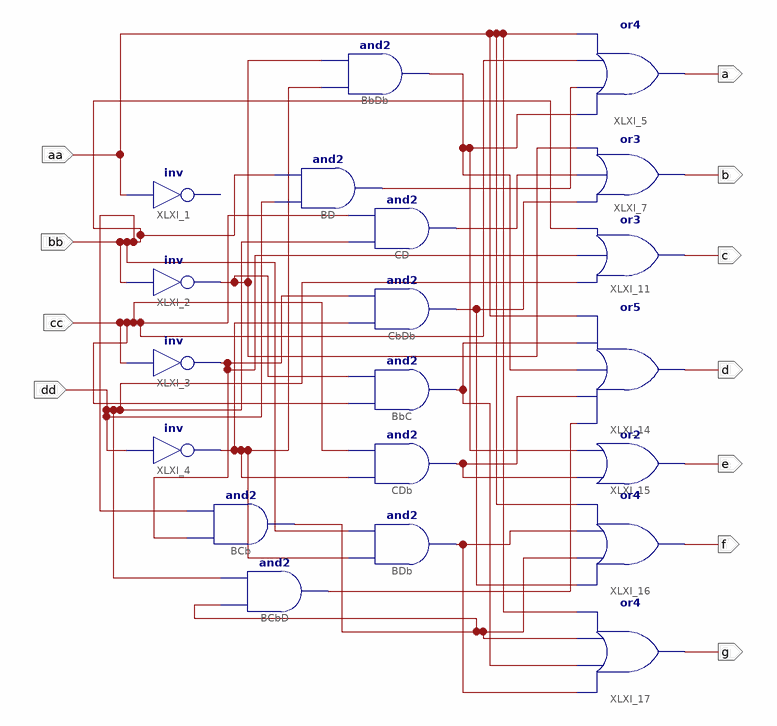
[diagram p0: schematic sheet 1]
// Xilinx ISE schematic decoder7segment.sch (spartan6) as structural Verilog: 20 symbols, 11 ports
module decoder7segment (
  input  aa,
  input  cc,
  input  bb,
  input  dd,
  output a,
  output d,
  output b,
  output c,
  output e,
  output f,
  output g
);

  wire XLXN_87, XLXN_91, XLXN_92, XLXN_97, XLXN_101, XLXN_104, XLXN_106, XLXN_107, XLXN_108, XLXN_111,
       XLXN_113, XLXN_114;

  // inv XLXI_1 has open pins: I=aa, O=open
  not XLXI_2 (XLXN_87, bb);
  not XLXI_3 (XLXN_92, cc);
  not XLXI_4 (XLXN_91, dd);
  or XLXI_5 (a, XLXN_107, XLXN_97, cc, aa);
  or XLXI_7 (b, XLXN_111, XLXN_101, XLXN_87);
  or XLXI_11 (c, dd, XLXN_92, bb);
  or XLXI_14 (d, XLXN_106, XLXN_108, XLXN_107, XLXN_104, aa);
  or XLXI_15 (e, XLXN_108, XLXN_107);
  or XLXI_16 (f, XLXN_111, XLXN_113, XLXN_114, aa);
  or XLXI_17 (g, XLXN_114, XLXN_104, XLXN_113, aa);
  and BD (XLXN_97, dd, bb);
  and BbDb (XLXN_107, XLXN_91, XLXN_87);
  and CD (XLXN_101, dd, cc);
  and CbDb (XLXN_111, XLXN_91, XLXN_92);
  and BbC (XLXN_104, cc, XLXN_87);
  and CDb (XLXN_108, XLXN_91, cc);
  and BCb (XLXN_113, XLXN_92, bb);
  and BCbD (XLXN_106, XLXN_113, dd);
  and BDb (XLXN_114, XLXN_91, bb);
endmodule
